# Altium schematic sheet Combined_parts.SchDoc
size A2; SheetNumber: 1; SheetTotal: 9
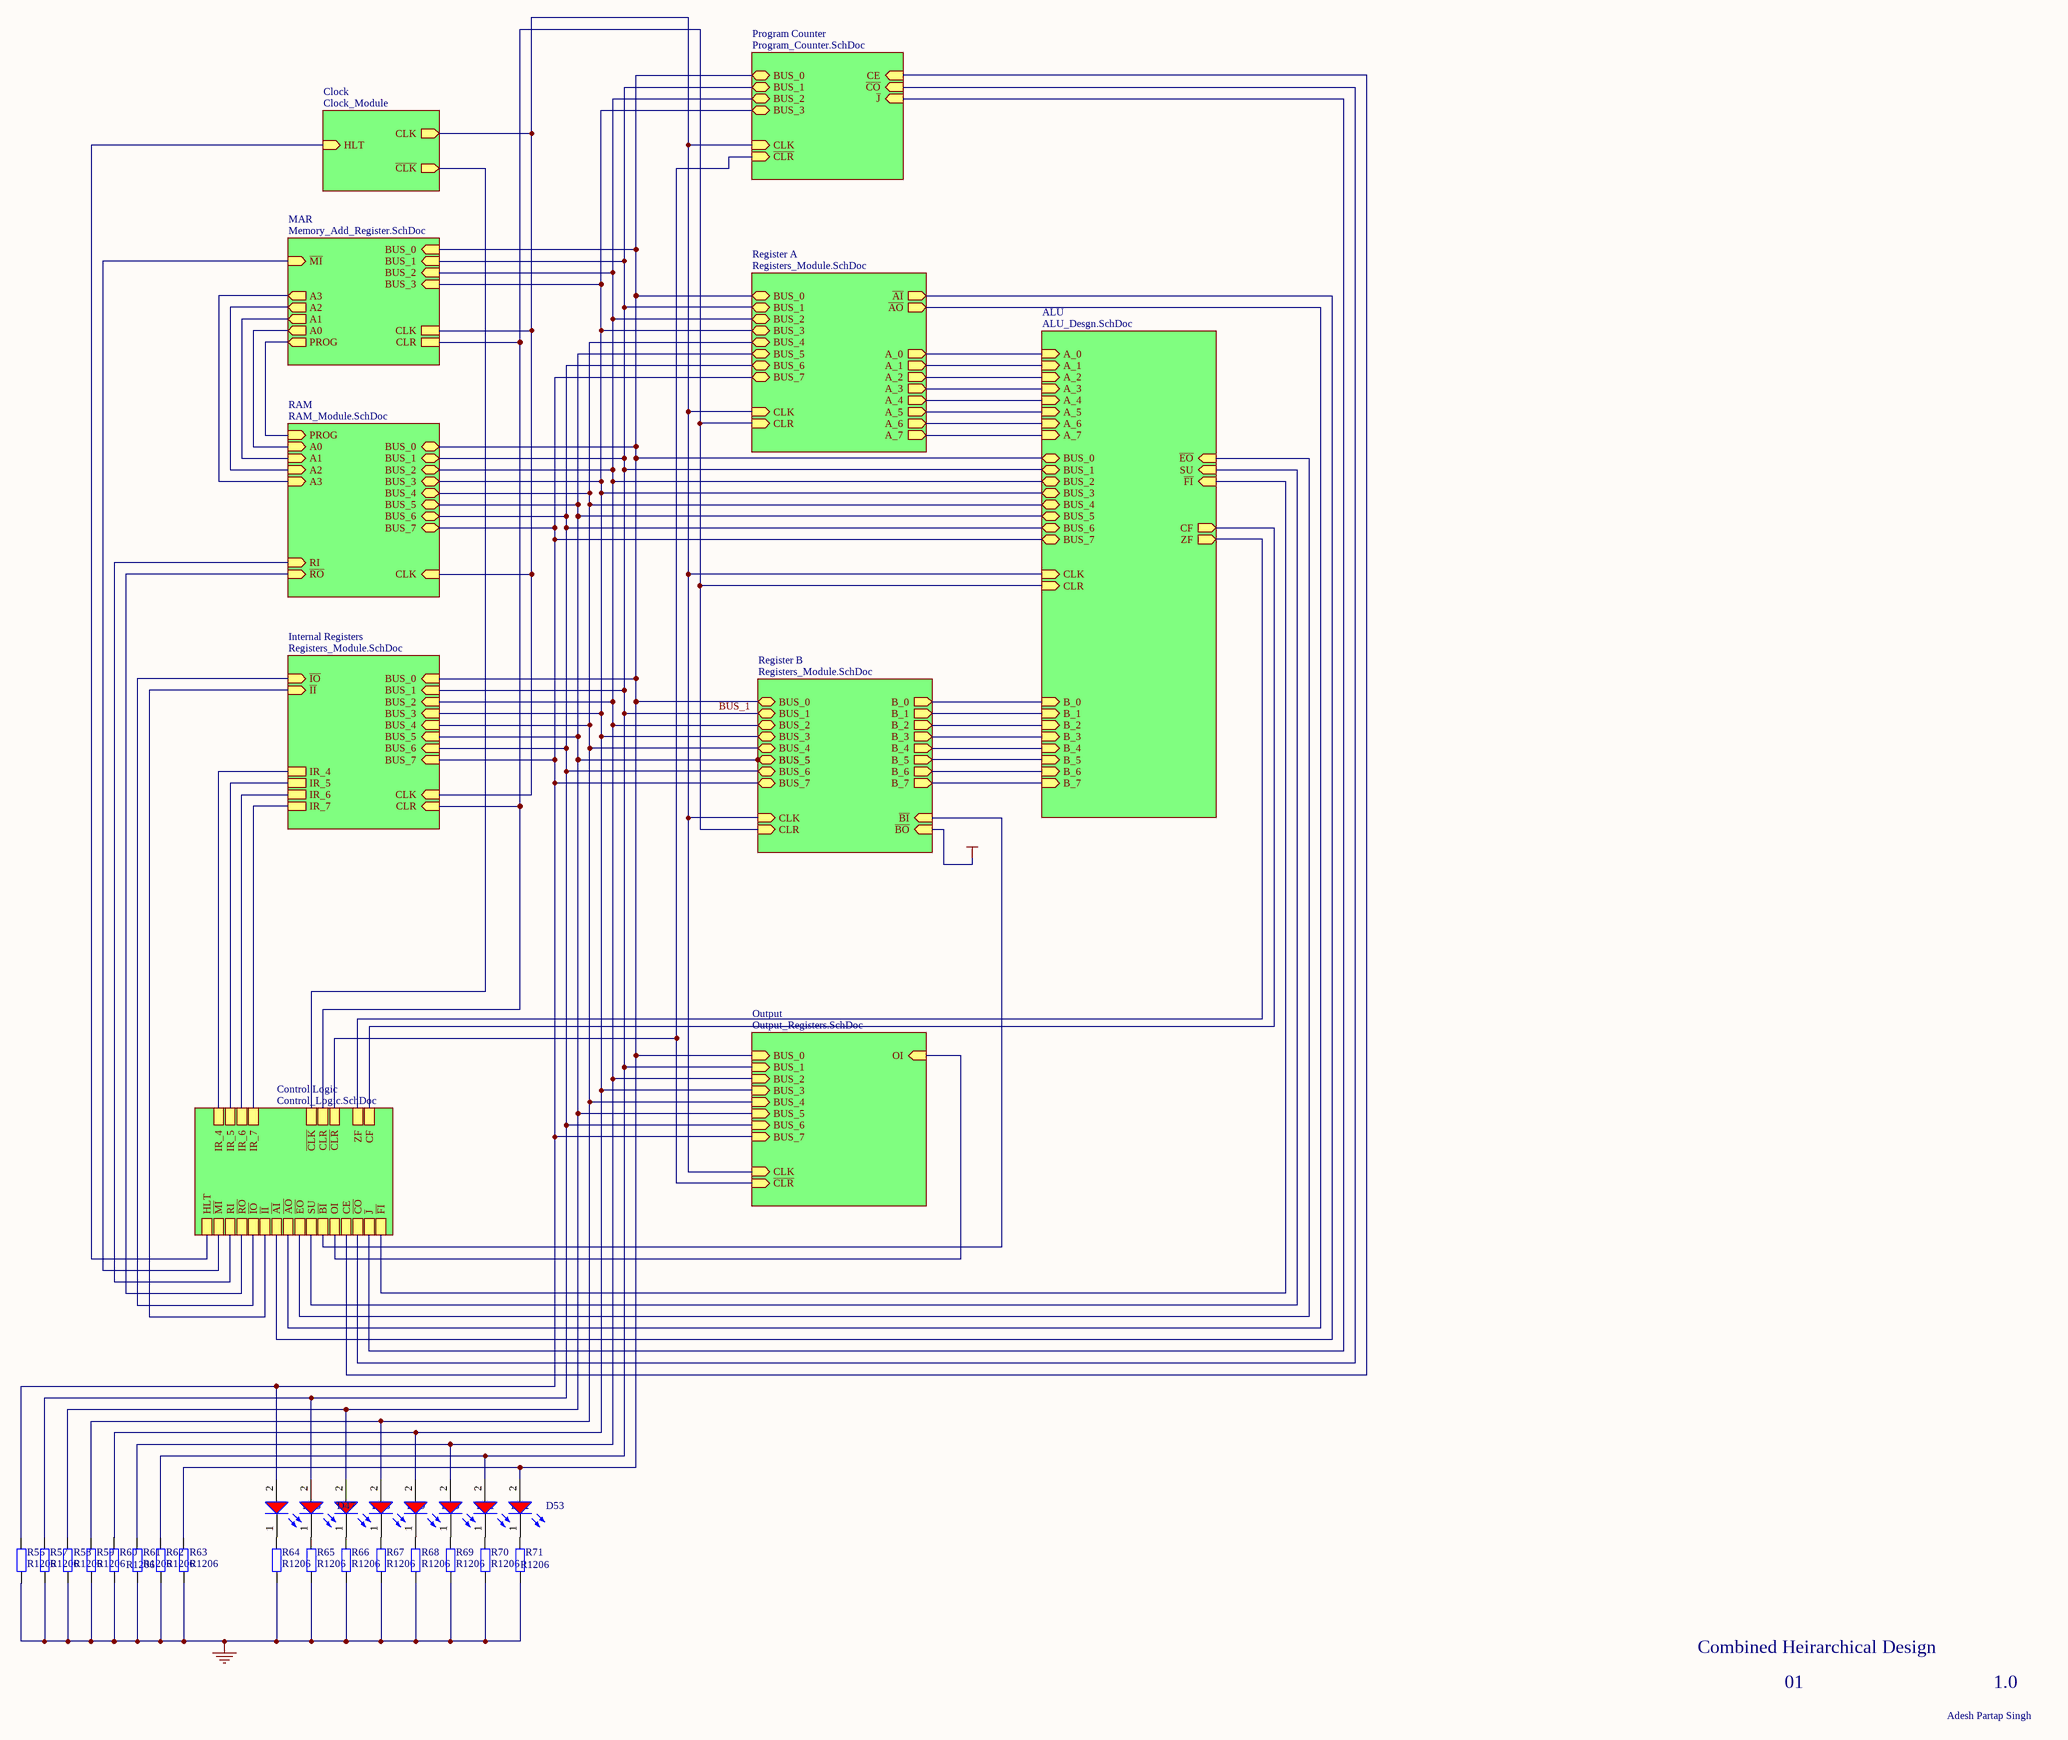
[diagram p0: Combined_parts.SchDoc]

## Parts
D46  151053RS03000  [WL-TMRW_D5.8H11.7]  (value not drawn)
D47  151053RS03000  [WL-TMRW_D5.8H11.7]  (value not drawn)
D48  151053RS03000  [WL-TMRW_D5.8H11.7]  (value not drawn)
D49  151053RS03000  [WL-TMRW_D5.8H11.7]  (value not drawn)
D50  151053RS03000  [WL-TMRW_D5.8H11.7]  (value not drawn)
D51  151053RS03000  [WL-TMRW_D5.8H11.7]  (value not drawn)
D52  151053RS03000  [WL-TMRW_D5.8H11.7]  (value not drawn)
D53  151053RS03000  [WL-TMRW_D5.8H11.7]  (value not drawn)
R56  R1206  [RES_1206]
R57  R1206  [RES_1206]
R58  R1206  [RES_1206]
R59  R1206  [RES_1206]
R60  R1206  [RES_1206]
R61  R1206  [RES_1206]
R62  R1206  [RES_1206]
R63  R1206  [RES_1206]
R64  R1206  [RES_1206]
R65  R1206  [RES_1206]
R66  R1206  [RES_1206]
R67  R1206  [RES_1206]
R68  R1206  [RES_1206]
R69  R1206  [RES_1206]
R70  R1206  [RES_1206]
R71  R1206  [RES_1206]

## Sub-sheets
ALU = ALU_Desgn.SchDoc: A_0 (in), A_2 (in), A_1 (in), A_3 (in), A_4 (in), A_5 (in), A_6 (in), BUS_0 (bidir), BUS_1 (bidir), BUS_2 (bidir), BUS_3 (bidir), BUS_4 (bidir), BUS_5 (bidir), BUS_6 (bidir), BUS_7 (bidir), CLK (in), CLR (in), B_0 (in), B_1 (in), B_2 (in), B_3 (in), B_4 (in), B_5 (in), B_7 (in), B_6 (in), ~{EO} (in), SU (in), ~{FI} (in), CF (out), ZF (out), A_7 (in)
Clock = Clock_Module: HLT (in), CLK (out), ~{CLK} (out)
Control Logic = Control_Logic.SchDoc: HLT, ~{MI}, RI, ~{RO}, ~{IO}, ~{II}, ~{AI}, ~{AO}, ~{EO}, SU, ~{BI}, OI, ~{J}, ~{FI}, ~{CO}, CE, IR_4, IR_5, IR_6, IR_7, ~{CLK}, CLR, ~{CLR}, ZF, CF
Internal Registers = Registers_Module.SchDoc: ~{IO} (in), ~{II} (in), IR_4, IR_5, IR_6, IR_7, BUS_0 (in), BUS_1 (in), BUS_2 (in), BUS_3 (in), BUS_4 (in), BUS_5 (in), BUS_6 (in), BUS_7 (in), CLK (in), CLR (in)
MAR = Memory_Add_Register.SchDoc: ~{MI} (in), A3 (out), A2 (out), PROG (out), A1 (out), A0 (out), BUS_0 (in), BUS_2 (in), BUS_1 (in), BUS_3 (in), CLK, CLR
Output = Output_Registers.SchDoc: BUS_0 (in), BUS_1 (in), BUS_2 (in), BUS_3 (in), BUS_4 (in), BUS_5 (in), BUS_6 (in), BUS_7 (in), CLK (in), ~{CLR} (in), OI (in)
Program Counter = Program_Counter.SchDoc: BUS_0 (bidir), BUS_1 (bidir), BUS_2 (bidir), BUS_3 (bidir), CLK (in), ~{CLR} (in), CE (in), ~{CO} (in), ~{J} (in)
RAM = RAM_Module.SchDoc: PROG (in), A0 (in), A1 (in), A2 (in), A3 (in), RI (in), ~{RO} (in), BUS_0 (bidir), BUS_1 (bidir), BUS_2 (bidir), BUS_3 (bidir), BUS_4 (bidir), BUS_5 (bidir), BUS_6 (bidir), BUS_7 (bidir), CLK (in)
Register A = Registers_Module.SchDoc: BUS_0 (bidir), BUS_1 (bidir), BUS_2 (bidir), BUS_3 (bidir), BUS_4 (bidir), BUS_6 (bidir), BUS_7 (bidir), BUS_5 (bidir), CLK (in), CLR (in), A_0 (out), A_7 (out), A_1 (out), A_2 (out), A_3 (out), A_4 (out), A_6 (out), A_5 (out), ~{AI} (out), ~{AO} (out)
Register B = Registers_Module.SchDoc: BUS_0 (bidir), BUS_1 (bidir), BUS_2 (bidir), BUS_3 (bidir), BUS_4 (bidir), BUS_5 (bidir), BUS_6 (bidir), BUS_7 (bidir), CLK (in), CLR (in), BUS_5 (bidir), B_0 (out), B_7 (out), B_1 (out), B_2 (out), B_3 (out), B_4 (out), B_6 (out), B_5 (out), ~{BI} (in), ~{BO} (in)

## Nets
GND: R56.1 R57.1 R58.1 R59.1 R60.1 R61.1 R62.1 R63.1 R64.1 R65.1 R66.1 R67.1 R68.1 R69.1 R70.1 R71.1
VCC: sheet Register B/~{BO}
BUS_1: D52.2(A) R62.2 ; sheet MAR/BUS_1, sheet RAM/BUS_1, sheet Program Counter/BUS_1, sheet Register A/BUS_1, sheet ALU/BUS_1, sheet Output/BUS_1, sheet Internal Registers/BUS_1, sheet Register B/BUS_1
NetD46_1: D46.1(K) R64.2
NetD46_2: D46.2(A) R56.2 ; sheet RAM/BUS_7, sheet Register A/BUS_7, sheet ALU/BUS_7, sheet Output/BUS_7, sheet Internal Registers/BUS_7, sheet Register B/BUS_7
NetD47_1: D47.1(K) R65.2
NetD47_2: D47.2(A) R57.2 ; sheet RAM/BUS_6, sheet Register A/BUS_6, sheet ALU/BUS_6, sheet Output/BUS_6, sheet Internal Registers/BUS_6, sheet Register B/BUS_6
NetD48_1: D48.1(K) R66.2
NetD48_2: D48.2(A) R58.2 ; sheet RAM/BUS_5, sheet Register A/BUS_5, sheet ALU/BUS_5, sheet Output/BUS_5, sheet Internal Registers/BUS_5, sheet Register B/BUS_5, sheet Register B/BUS_5
NetD49_1: D49.1(K) R67.2
NetD49_2: D49.2(A) R59.2 ; sheet RAM/BUS_4, sheet Register A/BUS_4, sheet ALU/BUS_4, sheet Output/BUS_4, sheet Internal Registers/BUS_4, sheet Register B/BUS_4
NetD50_1: D50.1(K) R68.2
NetD50_2: D50.2(A) R60.2 ; sheet MAR/BUS_3, sheet RAM/BUS_3, sheet Program Counter/BUS_3, sheet Register A/BUS_3, sheet ALU/BUS_3, sheet Output/BUS_3, sheet Internal Registers/BUS_3, sheet Register B/BUS_3
NetD51_1: D51.1(K) R69.2
NetD51_2: D51.2(A) R61.2 ; sheet MAR/BUS_2, sheet RAM/BUS_2, sheet Program Counter/BUS_2, sheet Register A/BUS_2, sheet ALU/BUS_2, sheet Output/BUS_2, sheet Internal Registers/BUS_2, sheet Register B/BUS_2
NetD52_1: D52.1(K) R70.2
NetD53_1: D53.1(K) R71.2
NetD53_2: D53.2(A) R63.2 ; sheet MAR/BUS_0, sheet RAM/BUS_0, sheet Program Counter/BUS_0, sheet Register A/BUS_0, sheet ALU/BUS_0, sheet Output/BUS_0, sheet Internal Registers/BUS_0, sheet Register B/BUS_0
(unnamed): sheet Clock/HLT, sheet Control Logic/HLT
(unnamed): sheet Clock/CLK, sheet MAR/CLK, sheet RAM/CLK, sheet Program Counter/CLK, sheet Register A/CLK, sheet ALU/CLK, sheet Output/CLK, sheet Internal Registers/CLK, sheet Register B/CLK
(unnamed): sheet Clock/~{CLK}, sheet Control Logic/~{CLK}
(unnamed): sheet MAR/~{MI}, sheet Control Logic/~{MI}
(unnamed): sheet MAR/A3, sheet RAM/A3
(unnamed): sheet MAR/A2, sheet RAM/A2
(unnamed): sheet MAR/PROG, sheet RAM/PROG
(unnamed): sheet MAR/A1, sheet RAM/A1
(unnamed): sheet MAR/A0, sheet RAM/A0
(unnamed): sheet MAR/CLR, sheet Control Logic/CLR, sheet Register A/CLR, sheet ALU/CLR, sheet Internal Registers/CLR, sheet Register B/CLR
(unnamed): sheet RAM/RI, sheet Control Logic/RI
(unnamed): sheet RAM/~{RO}, sheet Control Logic/~{RO}
(unnamed): sheet Control Logic/~{IO}, sheet Internal Registers/~{IO}
(unnamed): sheet Control Logic/~{II}, sheet Internal Registers/~{II}
(unnamed): sheet Control Logic/~{AI}, sheet Register A/~{AI}
(unnamed): sheet Control Logic/~{AO}, sheet Register A/~{AO}
(unnamed): sheet Control Logic/~{EO}, sheet ALU/~{EO}
(unnamed): sheet Control Logic/SU, sheet ALU/SU
(unnamed): sheet Control Logic/~{BI}, sheet Register B/~{BI}
(unnamed): sheet Control Logic/OI, sheet Output/OI
(unnamed): sheet Control Logic/~{J}, sheet Program Counter/~{J}
(unnamed): sheet Control Logic/~{FI}, sheet ALU/~{FI}
(unnamed): sheet Control Logic/~{CO}, sheet Program Counter/~{CO}
(unnamed): sheet Control Logic/CE, sheet Program Counter/CE
(unnamed): sheet Control Logic/IR_4, sheet Internal Registers/IR_4
(unnamed): sheet Control Logic/IR_5, sheet Internal Registers/IR_5
(unnamed): sheet Control Logic/IR_6, sheet Internal Registers/IR_6
(unnamed): sheet Control Logic/IR_7, sheet Internal Registers/IR_7
(unnamed): sheet Control Logic/~{CLR}, sheet Program Counter/~{CLR}, sheet Output/~{CLR}
(unnamed): sheet Control Logic/ZF, sheet ALU/ZF
(unnamed): sheet Control Logic/CF, sheet ALU/CF
(unnamed): sheet Register A/A_0, sheet ALU/A_0
(unnamed): sheet Register A/A_7, sheet ALU/A_7
(unnamed): sheet Register A/A_1, sheet ALU/A_1
(unnamed): sheet Register A/A_2, sheet ALU/A_2
(unnamed): sheet Register A/A_3, sheet ALU/A_3
(unnamed): sheet Register A/A_4, sheet ALU/A_4
(unnamed): sheet Register A/A_6, sheet ALU/A_6
(unnamed): sheet Register A/A_5, sheet ALU/A_5
(unnamed): sheet ALU/B_0, sheet Register B/B_0
(unnamed): sheet ALU/B_1, sheet Register B/B_1
(unnamed): sheet ALU/B_2, sheet Register B/B_2
(unnamed): sheet ALU/B_3, sheet Register B/B_3
(unnamed): sheet ALU/B_4, sheet Register B/B_4
(unnamed): sheet ALU/B_5, sheet Register B/B_5
(unnamed): sheet ALU/B_7, sheet Register B/B_7
(unnamed): sheet ALU/B_6, sheet Register B/B_6

## Notes on the sheet
- Combined Heirarchical Design
- 01
- Adesh Partap Singh
- 1.0

## Library data of the parts
D46-D53 = CMP-1489-00007-2: NexarPartId: 29717818; Viewing Angle: 30°; Test Current: 20mA; Forward Voltage: 1.9V; Lens Size: 5mm; Wavelength: 623nm; Lens Style: Circular, Clear, Round; Luminous Intensity: 5cd; Peak Wavelength: 631nm; Max Reverse Voltage (DC): 5V; Forward Current: 100mA; Color: Red; Height: 8.6mm; Packaging: Bulk; Length: 5mm; Dominant Wavelength: 623nm; RoHS: Compliant; Mount: Through Hole; Max Operating Temperature: 85°C; Width: 5mm; Case/Package: Radial; Min Operating Temperature: -40°C; REACH SVHC: Unknown
R56-R71 = RES_1206: Resistor SMD 1206; Manufacturer: *; Manufacturer Part Number: *; Distributor Link: *; LCSC: *